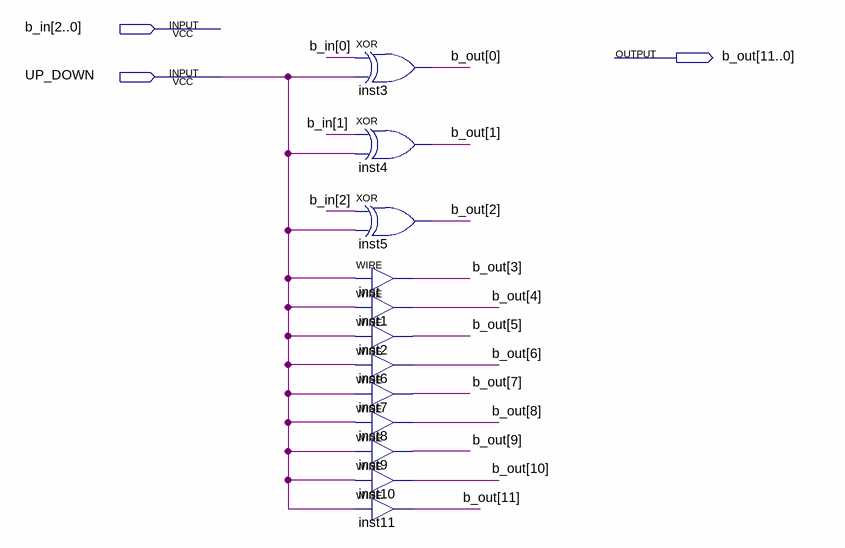
[diagram p0: schematic sheet]
// Quartus schematic xor33.bdf as structural Verilog: 12 symbols, 3 pins
module xor33 (
  input  [2:0] b_in,
  input  UP_DOWN,
  output [11:0] b_out
);

  xor inst3 (b_out[0], b_in[0], UP_DOWN);
  xor inst4 (b_out[1], b_in[1], UP_DOWN);
  xor inst5 (b_out[2], b_in[2], UP_DOWN);
  assign b_out[3] = UP_DOWN;  // WIRE inst
  assign b_out[4] = UP_DOWN;  // WIRE inst1
  assign b_out[5] = UP_DOWN;  // WIRE inst2
  assign b_out[6] = UP_DOWN;  // WIRE inst6
  assign b_out[7] = UP_DOWN;  // WIRE inst7
  assign b_out[8] = UP_DOWN;  // WIRE inst8
  assign b_out[9] = UP_DOWN;  // WIRE inst9
  assign b_out[10] = UP_DOWN;  // WIRE inst10
  assign b_out[11] = UP_DOWN;  // WIRE inst11
endmodule
